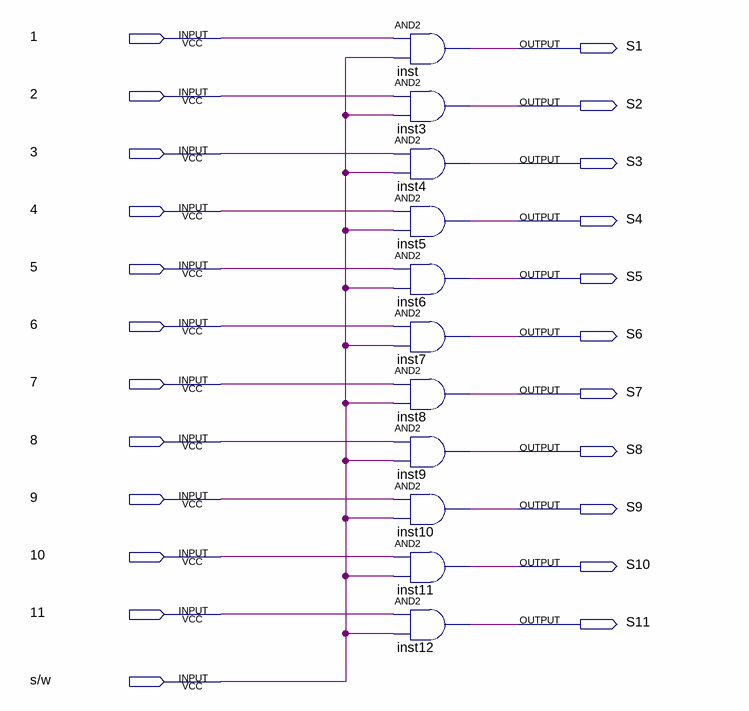
[diagram p0: schematic sheet]
// Quartus schematic Transicao.bdf as structural Verilog: 11 symbols, 23 pins
module Transicao (
  input  \1 ,
  input  \2 ,
  input  \3 ,
  input  \4 ,
  input  \5 ,
  input  \6 ,
  input  \7 ,
  input  \8 ,
  input  \9 ,
  input  \10 ,
  input  \11 ,
  input  \s/w ,
  output S1,
  output S2,
  output S3,
  output S4,
  output S5,
  output S6,
  output S7,
  output S8,
  output S9,
  output S10,
  output S11
);

  and inst (S1, \1 , \s/w );
  and inst3 (S2, \2 , \s/w );
  and inst4 (S3, \3 , \s/w );
  and inst5 (S4, \4 , \s/w );
  and inst6 (S5, \5 , \s/w );
  and inst7 (S6, \6 , \s/w );
  and inst8 (S7, \7 , \s/w );
  and inst9 (S8, \8 , \s/w );
  and inst10 (S9, \9 , \s/w );
  and inst11 (S10, \10 , \s/w );
  and inst12 (S11, \11 , \s/w );
endmodule
